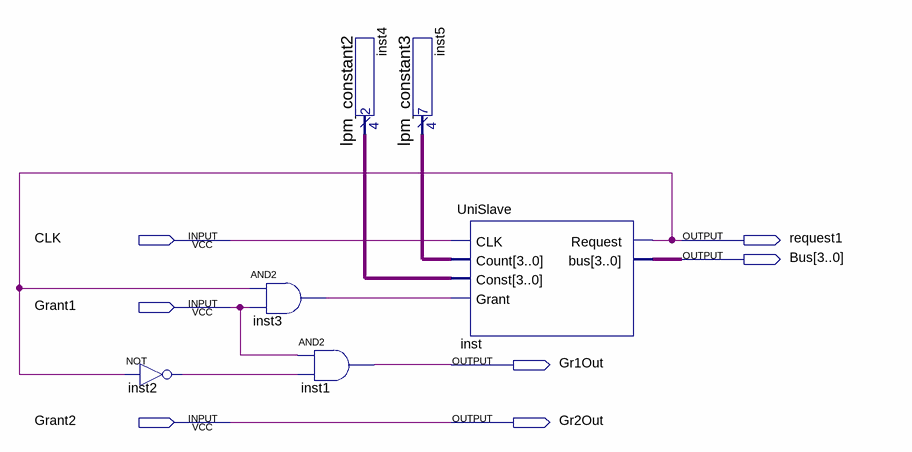
[diagram p0: schematic sheet]
// Quartus schematic Block2.bdf as structural Verilog: 6 symbols, 7 pins
module Block2 (
  input  CLK,
  input  Grant1,
  input  Grant2,
  output request1,
  output [3:0] Bus,
  output Gr1Out,
  output Gr2Out
);

  wire inst2_out, inst3_out;
  wire [3:0] inst4_result, inst5_result;

  not inst2 (inst2_out, request1);
  and inst3 (inst3_out, request1, Grant1);
  lpm_constant2 inst4 (.result(inst4_result));
  and inst1 (Gr1Out, Grant1, inst2_out);
  lpm_constant3 inst5 (.result(inst5_result));
  UniSlave inst (
    .CLK(CLK), .Count(inst5_result), .Const(inst4_result), .Grant(inst3_out), .Request(request1), .bus(Bus));

  assign Gr2Out = Grant2;
endmodule
